# Altium schematic sheet Nucleo.SchDoc
size A
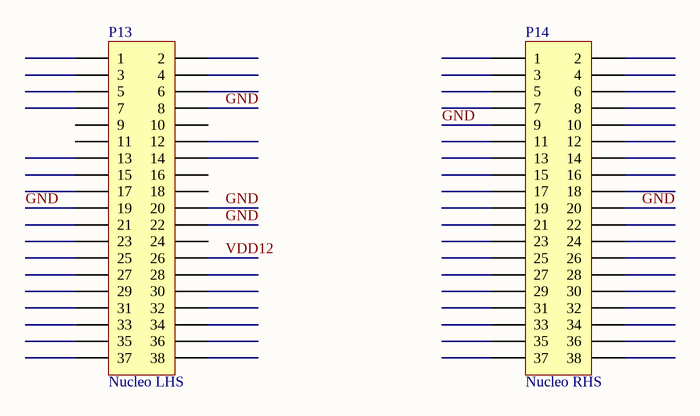
[diagram p0: Nucleo.SchDoc]

## Parts
P13  Nucleo LHS  [HDR2X19]
P14  Nucleo RHS  [HDR2X19]

## Nets
GND: P13.8 P13.19 P13.20 P13.22 P14.9 P14.20
VDD12: P13.26

Not connected (* = marked no-connect by the designer): P13 1 2 3 4 5 6 7 9 10 11 12 13 14 15 16 17 18 21 23 24 25 27 28 29 30 31 32 33 34 35 36 37 38; P14 1 2 3 4 5 6 7 8 10 11 12 13 14 15 16 17 18 19 21 22 23 24 25 26 27 28 29 30 31 32 33 34 35 36 37 38

## Library data of the parts
P13 P14 = Header 19X2: Header, 19-Pin, Dual row; LatestRevisionDate: 17-Jul-2002; LatestRevisionNote: Re-released for DXP Platform.; Publisher: Altium Limited